# Altium schematic sheet HIVE_SIGHT_TOP.SchDoc
size Tabloid; SheetNumber: 3; SheetTotal: 6; Sheet_Name: Top; Size: 11x17
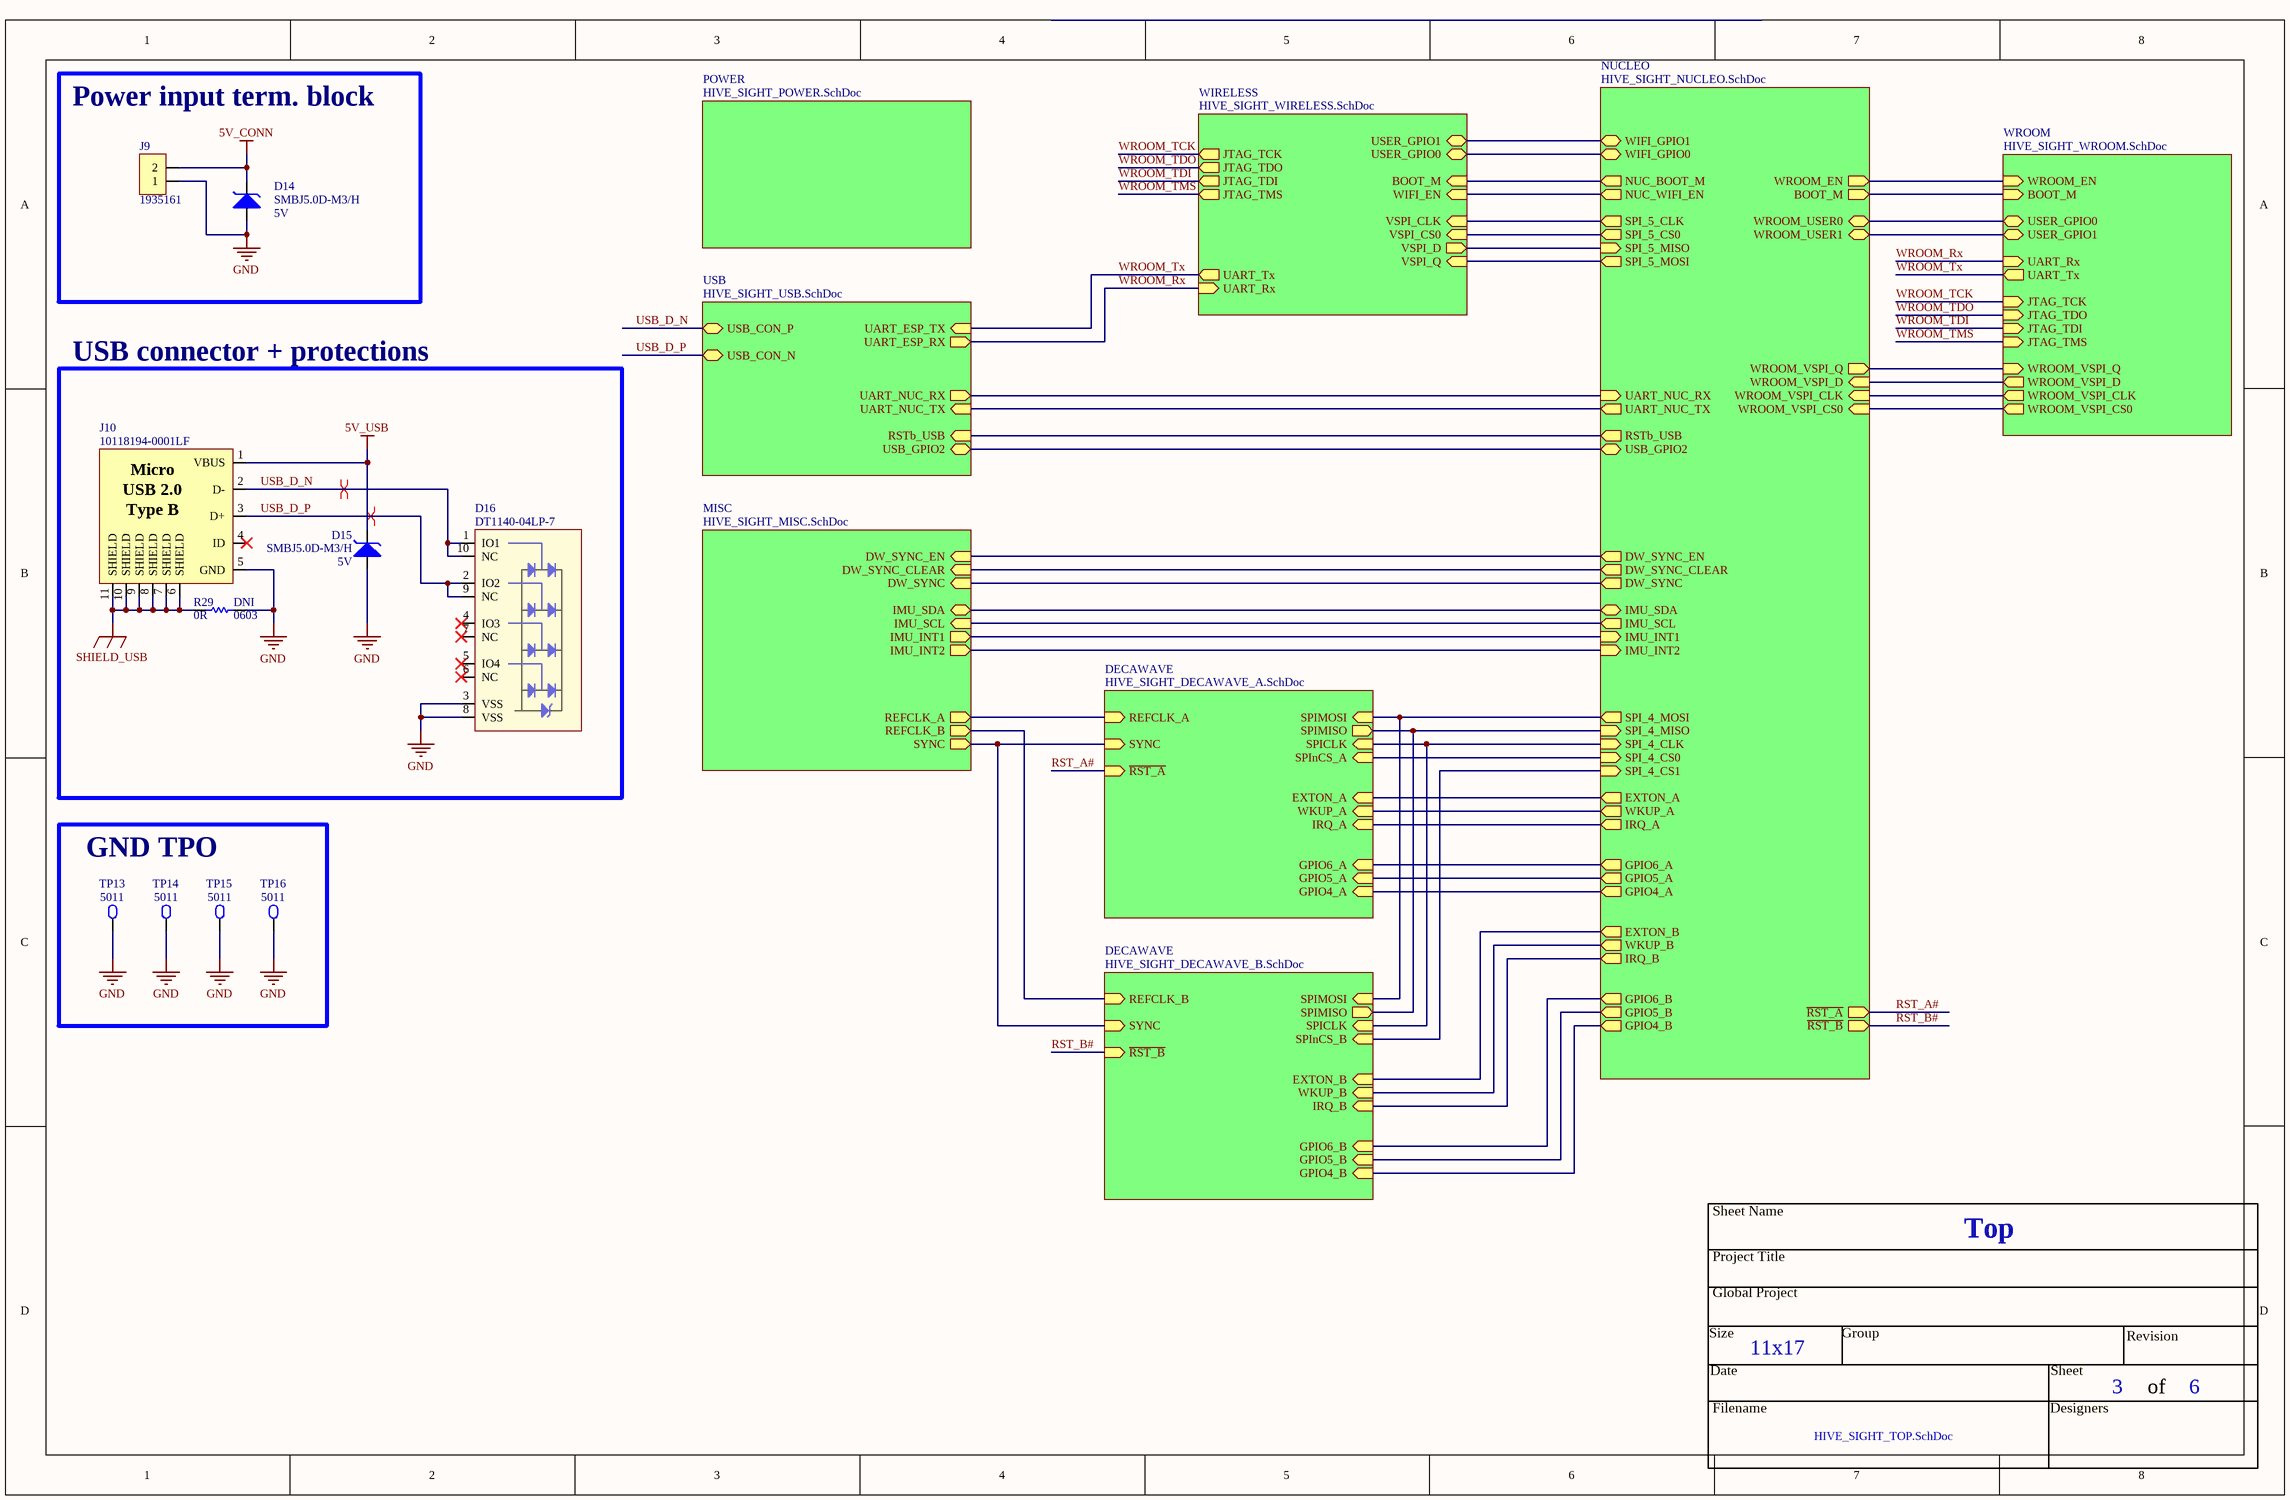
[diagram p0: HIVE_SIGHT_TOP.SchDoc]

## Parts
D14  SMBJ5.0D-M3/H  value 5V  [TVS_SMBJ5.0D-M3/H]
D15  SMBJ5.0D-M3/H  value 5V  [TVS_SMBJ5.0D-M3/H]
D16  DT1140-04LP-7  [TVS_DATA_DT1140-04LP-7]
J9  1935161  [CON_ 1935161]
J10  10118194-0001LF  [CON_USB_10118194-0001LF]
R29  value 0R  Assembly Note: DNI  Package: 0603  [RES_0603]  (hidden comment: RC0603JR-070RL)
TP13  5011  [TPO_5011]
TP14  5011  [TPO_5011]
TP15  5011  [TPO_5011]
TP16  5011  [TPO_5011]

## Blocks framed on the sheet
Power input term. block: D14 J9
USB connector + protections: D15 D16 J10 R29
GND TPO: TP13-TP16

## Sub-sheets
DECAWAVE = HIVE_SIGHT_DECAWAVE_A.SchDoc: SPInCS_A (in), SPIMOSI (in), SPIMISO (out), SPICLK (in), WKUP_A (in), IRQ_A (in), SYNC (in), REFCLK_A (in), ~{RST_A} (in), GPIO4_A (in), GPIO5_A (in), GPIO6_A (in), EXTON_A (in)
DECAWAVE = HIVE_SIGHT_DECAWAVE_B.SchDoc: SPInCS_B (in), SPIMOSI (in), SPICLK (in), WKUP_B (in), IRQ_B (in), REFCLK_B (in), ~{RST_B} (in), SYNC (in), GPIO4_B (in), GPIO5_B (in), GPIO6_B (in), EXTON_B (in), SPIMISO (out)
MISC = HIVE_SIGHT_MISC.SchDoc: IMU_INT2 (out), IMU_INT1 (out), IMU_SDA (bidir), IMU_SCL (in), REFCLK_A (out), REFCLK_B (out), SYNC (out), DW_SYNC_EN (in), DW_SYNC_CLEAR (in), DW_SYNC (in)
NUCLEO = HIVE_SIGHT_NUCLEO.SchDoc: IMU_INT2 (in), IMU_SDA (bidir), IMU_INT1 (in), IMU_SCL (out), SPI_4_CLK (in), SPI_4_CS1 (in), SPI_4_MOSI (out), SPI_4_CS0 (in), SPI_4_MISO (in), EXTON_A (out), WKUP_A (out), IRQ_A (out), GPIO6_A (out), GPIO5_A (out), GPIO4_A (out), EXTON_B (out), WKUP_B (out), IRQ_B (out), GPIO6_B (out), GPIO5_B (out), GPIO4_B (out), DW_SYNC_EN (out), DW_SYNC_CLEAR (out), DW_SYNC (out), ~{RST_A} (out), ~{RST_B} (out), UART_NUC_RX (in), UART_NUC_TX (out), RSTb_USB (out), USB_GPIO2 (bidir), SPI_5_MISO (in), SPI_5_CLK (out), SPI_5_CS0 (out), SPI_5_MOSI (out), NUC_BOOT_M (out), NUC_WIFI_EN (out), WIFI_GPIO1 (bidir), WIFI_GPIO0 (bidir), WROOM_EN (out), WROOM_VSPI_CS0 (in), WROOM_VSPI_CLK (in), WROOM_USER0 (bidir), WROOM_VSPI_D (in), WROOM_USER1 (bidir), BOOT_M (out), WROOM_VSPI_Q (out)
POWER = HIVE_SIGHT_POWER.SchDoc: no entries
USB = HIVE_SIGHT_USB.SchDoc: UART_NUC_TX (in), USB_CON_P (bidir), UART_ESP_TX (in), UART_NUC_RX (out), USB_CON_N (bidir), UART_ESP_RX (out), USB_GPIO2 (bidir), RSTb_USB (in)
WIRELESS = HIVE_SIGHT_WIRELESS.SchDoc: WIFI_EN (in), VSPI_CS0 (in), UART_Rx (in), VSPI_Q (in), VSPI_CLK (in), VSPI_D (out), BOOT_M (in), UART_Tx (out), USER_GPIO0 (bidir), USER_GPIO1 (bidir), JTAG_TMS (out), JTAG_TCK (out), JTAG_TDI (out), JTAG_TDO (out)
WROOM = HIVE_SIGHT_WROOM.SchDoc: WROOM_EN (in), WROOM_VSPI_CS0 (out), JTAG_TMS (in), WROOM_VSPI_CLK (out), JTAG_TCK (in), UART_Tx (out), JTAG_TDI (in), JTAG_TDO (in), USER_GPIO0 (bidir), WROOM_VSPI_D (out), USER_GPIO1 (bidir), UART_Rx (in), BOOT_M (in), WROOM_VSPI_Q (in)

## Nets
5V_CONN: D14.2(K) J9.2
5V_USB: D15.2(K) J10.1(VBUS)
GND: D14.1(A) D15.1(A) D16.3(VSS) D16.8(VSS) J9.1 J10.5(GND) R29.1 TP13.1 TP14.1 TP15.1 TP16.1
SHIELD_USB: J10.6(SHIELD) J10.7(SHIELD) J10.8(SHIELD) J10.9(SHIELD) J10.10(SHIELD) J10.11(SHIELD) R29.2
RST_A#: sheet DECAWAVE/~{RST_A}, sheet NUCLEO/~{RST_A}
RST_B#: sheet DECAWAVE/~{RST_B}, sheet NUCLEO/~{RST_B}
USB_D_N: D16.1(IO1) D16.10(NC) J10.2(D-) ; sheet USB/USB_CON_P
USB_D_P: D16.2(IO2) D16.9(NC) J10.3(D+) ; sheet USB/USB_CON_N
WROOM_Rx: sheet USB/UART_ESP_RX, sheet WIRELESS/UART_Rx, sheet WROOM/UART_Rx
WROOM_TCK: sheet WIRELESS/JTAG_TCK, sheet WROOM/JTAG_TCK
WROOM_TDI: sheet WIRELESS/JTAG_TDI, sheet WROOM/JTAG_TDI
WROOM_TDO: sheet WIRELESS/JTAG_TDO, sheet WROOM/JTAG_TDO
WROOM_TMS: sheet WIRELESS/JTAG_TMS, sheet WROOM/JTAG_TMS
WROOM_Tx: sheet USB/UART_ESP_TX, sheet WIRELESS/UART_Tx, sheet WROOM/UART_Tx
(unnamed): sheet USB/UART_NUC_TX, sheet NUCLEO/UART_NUC_TX
(unnamed): sheet USB/UART_NUC_RX, sheet NUCLEO/UART_NUC_RX
(unnamed): sheet USB/USB_GPIO2, sheet NUCLEO/USB_GPIO2
(unnamed): sheet USB/RSTb_USB, sheet NUCLEO/RSTb_USB
(unnamed): sheet DECAWAVE/SPInCS_A, sheet NUCLEO/SPI_4_CS0
(unnamed): sheet DECAWAVE/SPIMOSI, sheet DECAWAVE/SPIMOSI, sheet NUCLEO/SPI_4_MOSI
(unnamed): sheet DECAWAVE/SPIMISO, sheet DECAWAVE/SPIMISO, sheet NUCLEO/SPI_4_MISO
(unnamed): sheet DECAWAVE/SPICLK, sheet DECAWAVE/SPICLK, sheet NUCLEO/SPI_4_CLK
(unnamed): sheet DECAWAVE/WKUP_A, sheet NUCLEO/WKUP_A
(unnamed): sheet DECAWAVE/IRQ_A, sheet NUCLEO/IRQ_A
(unnamed): sheet DECAWAVE/SYNC, sheet DECAWAVE/SYNC, sheet MISC/SYNC
(unnamed): sheet DECAWAVE/REFCLK_A, sheet MISC/REFCLK_A
(unnamed): sheet DECAWAVE/GPIO4_A, sheet NUCLEO/GPIO4_A
(unnamed): sheet DECAWAVE/GPIO5_A, sheet NUCLEO/GPIO5_A
(unnamed): sheet DECAWAVE/GPIO6_A, sheet NUCLEO/GPIO6_A
(unnamed): sheet DECAWAVE/EXTON_A, sheet NUCLEO/EXTON_A
(unnamed): sheet WIRELESS/WIFI_EN, sheet NUCLEO/NUC_WIFI_EN
(unnamed): sheet WIRELESS/VSPI_CS0, sheet NUCLEO/SPI_5_CS0
(unnamed): sheet WIRELESS/VSPI_Q, sheet NUCLEO/SPI_5_MOSI
(unnamed): sheet WIRELESS/VSPI_CLK, sheet NUCLEO/SPI_5_CLK
(unnamed): sheet WIRELESS/VSPI_D, sheet NUCLEO/SPI_5_MISO
(unnamed): sheet WIRELESS/BOOT_M, sheet NUCLEO/NUC_BOOT_M
(unnamed): sheet WIRELESS/USER_GPIO0, sheet NUCLEO/WIFI_GPIO0
(unnamed): sheet WIRELESS/USER_GPIO1, sheet NUCLEO/WIFI_GPIO1
(unnamed): sheet DECAWAVE/SPInCS_B, sheet NUCLEO/SPI_4_CS1
(unnamed): sheet DECAWAVE/WKUP_B, sheet NUCLEO/WKUP_B
(unnamed): sheet DECAWAVE/IRQ_B, sheet NUCLEO/IRQ_B
(unnamed): sheet DECAWAVE/REFCLK_B, sheet MISC/REFCLK_B
(unnamed): sheet DECAWAVE/GPIO4_B, sheet NUCLEO/GPIO4_B
(unnamed): sheet DECAWAVE/GPIO5_B, sheet NUCLEO/GPIO5_B
(unnamed): sheet DECAWAVE/GPIO6_B, sheet NUCLEO/GPIO6_B
(unnamed): sheet DECAWAVE/EXTON_B, sheet NUCLEO/EXTON_B
(unnamed): sheet MISC/IMU_INT2, sheet NUCLEO/IMU_INT2
(unnamed): sheet MISC/IMU_INT1, sheet NUCLEO/IMU_INT1
(unnamed): sheet MISC/IMU_SDA, sheet NUCLEO/IMU_SDA
(unnamed): sheet MISC/IMU_SCL, sheet NUCLEO/IMU_SCL
(unnamed): sheet MISC/DW_SYNC_EN, sheet NUCLEO/DW_SYNC_EN
(unnamed): sheet MISC/DW_SYNC_CLEAR, sheet NUCLEO/DW_SYNC_CLEAR
(unnamed): sheet MISC/DW_SYNC, sheet NUCLEO/DW_SYNC
(unnamed): sheet NUCLEO/WROOM_EN, sheet WROOM/WROOM_EN
(unnamed): sheet NUCLEO/WROOM_VSPI_CS0, sheet WROOM/WROOM_VSPI_CS0
(unnamed): sheet NUCLEO/WROOM_VSPI_CLK, sheet WROOM/WROOM_VSPI_CLK
(unnamed): sheet NUCLEO/WROOM_USER0, sheet WROOM/USER_GPIO0
(unnamed): sheet NUCLEO/WROOM_VSPI_D, sheet WROOM/WROOM_VSPI_D
(unnamed): sheet NUCLEO/WROOM_USER1, sheet WROOM/USER_GPIO1
(unnamed): sheet NUCLEO/BOOT_M, sheet WROOM/BOOT_M
(unnamed): sheet NUCLEO/WROOM_VSPI_Q, sheet WROOM/WROOM_VSPI_Q

Not connected (* = marked no-connect by the designer): D16 4(IO3)* 5(IO4)* 6(NC)* 7(NC)*; J10 4(ID)*

## Layout directives
differential pair: USB_D_N, USB_D_P

## Notes on the sheet
- Sheet Name
- Project Title
- Global Project
- Revision
- Size
- Date
- Group
- Sheet
- of
- Filename
- Designers
- (in symbol CON_USB_10118194-0001LF) Micro; USB 2.0; Type B

## Library data of the parts
D14 D15 = TVS_SMBJ5.0D-M3/H: TVS - DIODE 5V 9.1V- DO-214AA; Manufacturer #1: Vishay Semiconductor Diodes Division; Current Rating: 65.9A peak pulse; GRAMS Lib Spec: 2.8c; Magnetic Material: Unknown; Polarized: Yes; Power Max: 600W peak pulse; Voltage Rating: Vbr = 6.5, Vc = 9.1; CreatedBy/Date: Louis-Daniel Gaulin / 27-02-2020; HelpURL: http://www.vishay.com/docs/87606/87606.pdf; Manufacturer #2: *; Package: DO-214AA; Part Number #1: SMBJ5.0D-M3/H; Part Number #2: *; Supplier 1: Digi-Key; Supplier Part Number 1: SMBJ5.0D-M3/HGICT-ND; Temperature: -55°C ~ 150°C; Tolerance: *; VerifiedBy: C.Paulin - 09/03/2020; Assembly Type: SMD
D16 = TVS_DATA_DT1140-04LP-7: TVS - DIODE 5.5V 10V - 10-UFDFN; Manufacturer #1: Diodes Incorporated; Value: 5.5V @ 1mA (Reverse Standoff); Voltage Rating: 6V (Breakdown); Current Rating: 6A (8/20µs); Power Max: 60W (8/20µs); GRAMS Lib Spec: 2.8; Note: Fooprint created from tpd4e05u06 (TI) for manufacturability (soldermask); Magnetic Material: Unknown; Polarized: Yes; Tolerance: -; HelpURL: https://www.diodes.com/assets/Datasheets/DT1140-04LP.pdf; CreatedBy/Date: Joël Lemay 2019-11-20; VerifiedBy: C.Paulin - 21/11/2019; Temperature: -55°C~85°C; Package: 10-UFDFN; Manufacturer #2: -; Assembly Type: SMD; Part Number #2: -; Part Number #1: DT1140-04LP-7; Supplier 1: Digi-Key; Supplier Part Number 1: DT1140-04LP-7DICT-ND; Cryo: UNKNOWN
J9 = CON_1935161: CON - TERM BLK 2POS SIDE ENTRY 5MM PCB - TH - 14-26 AWG; Manufacturer #1: Phoenix Contact; Current Rating: 17.5A; Magnetic Material: Unknown; Polarized: Yes; Voltage Rating: 400V; GRAMS Lib Spec: 2.8; Assembly Type: TH; Manufacturer #2: *; Note: *; Part Number #1: 1935161; Part Number #2: *; Package: TH; Power Max: *; Value: *; Temperature: -40 °C ~ 100 °C; HelpURL: https://media.digikey.com/pdf/Data%20Sheets/Phoenix%20Contact%20PDFs/1935161.pdf; CreatedBy/Date: Louis-Daniel Gaulin / 02-11-2020; Supplier 1: Digi-Key; Supplier Part Number 1: 277-1667-ND; Tolerance: *; VerifiedBy: Philippe Arsenault/2020-11-06; Cryo: UNKNOWN
J10 = CON_USB_10118194-0001LF: CON - USB MICRO B RECPT SMT R/A - 4PIN; Manufacturer #1: Amphenol FCI; Value: USB - Micro B; Voltage Rating: 100VAC; Current Rating: 1.8A; GRAMS Lib Spec: 2.8; Magnetic Material: YES; Tolerance: *; Power Max: *; HelpURL: https://cdn.amphenol-icc.com/media/wysiwyg/files/drawing/10118194.pdf; CreatedBy/Date: Arnaud Samson - 09/07/18; VerifiedBy: Jonathan Bouchard 2018-07-12; Temperature: -30°C ~ 80°C; Package: 5-SMD; Manufacturer #2: *; Note: *; Assembly Type: SMD; Part Number #2: *; Part Number #1: 10118194-0001LF; Polarized: YES; Supplier 1: Digi-Key; Supplier Part Number 1: 609-4618-1-ND
R29 = RES_RC0603JR-070RL: RES - 0 ohm jumper 1/10W - 0603; Manufacturer #1: Yageo; GRAMS Lib Spec: 2.8; Magnetic Material: Unknown; Polarized: No; Assembly Type: SMD; CreatedBy/Date: L-P Gauthier 2018-10-30; Current Rating: *; HelpURL: http://www.yageo.com/documents/recent/PYu-RC_Group_51_RoHS_L_9.pdf; Manufacturer #2: *; Part Number #1: RC0603JR-070RL; Part Number #2: *; Power Max: 1/10W; Temperature: -55°C ~ 155°C; VerifiedBy: Caroline Paulin  - 5/11/2018; Voltage Rating: -; Supplier 1: Digi-Key; Supplier Part Number 1: 311-0.0GRCT-ND
TP13-TP16 = TPO_5011: TPO - TEST POINT - TH; Manufacturer #1: Keystone Electronics; Polarized: No; Magnetic Material: UNKNOWN; GRAMS Lib Spec: 2.8; Current Rating: *; Manufacturer #2: *; Note: *; Power Max: *; Value: *; Part Number #1: 5011; Part Number #2: *; HelpURL: https://www.keyelco.com/userAssets/file/M65p56.pdf; Assembly Type: TH; Package: *; CreatedBy/Date: Louis-Daniel Gauli / 02-11-2020; Temperature: *; Tolerance: *; VerifiedBy: Philippe Arsenault/2020-11-06; Voltage Rating: *; Cryo: UNKNOWN; Supplier 1: Digi-Key